# Altium schematic sheet Sheet1(test).SchDoc: ESP8266 Wifi Module
size A4
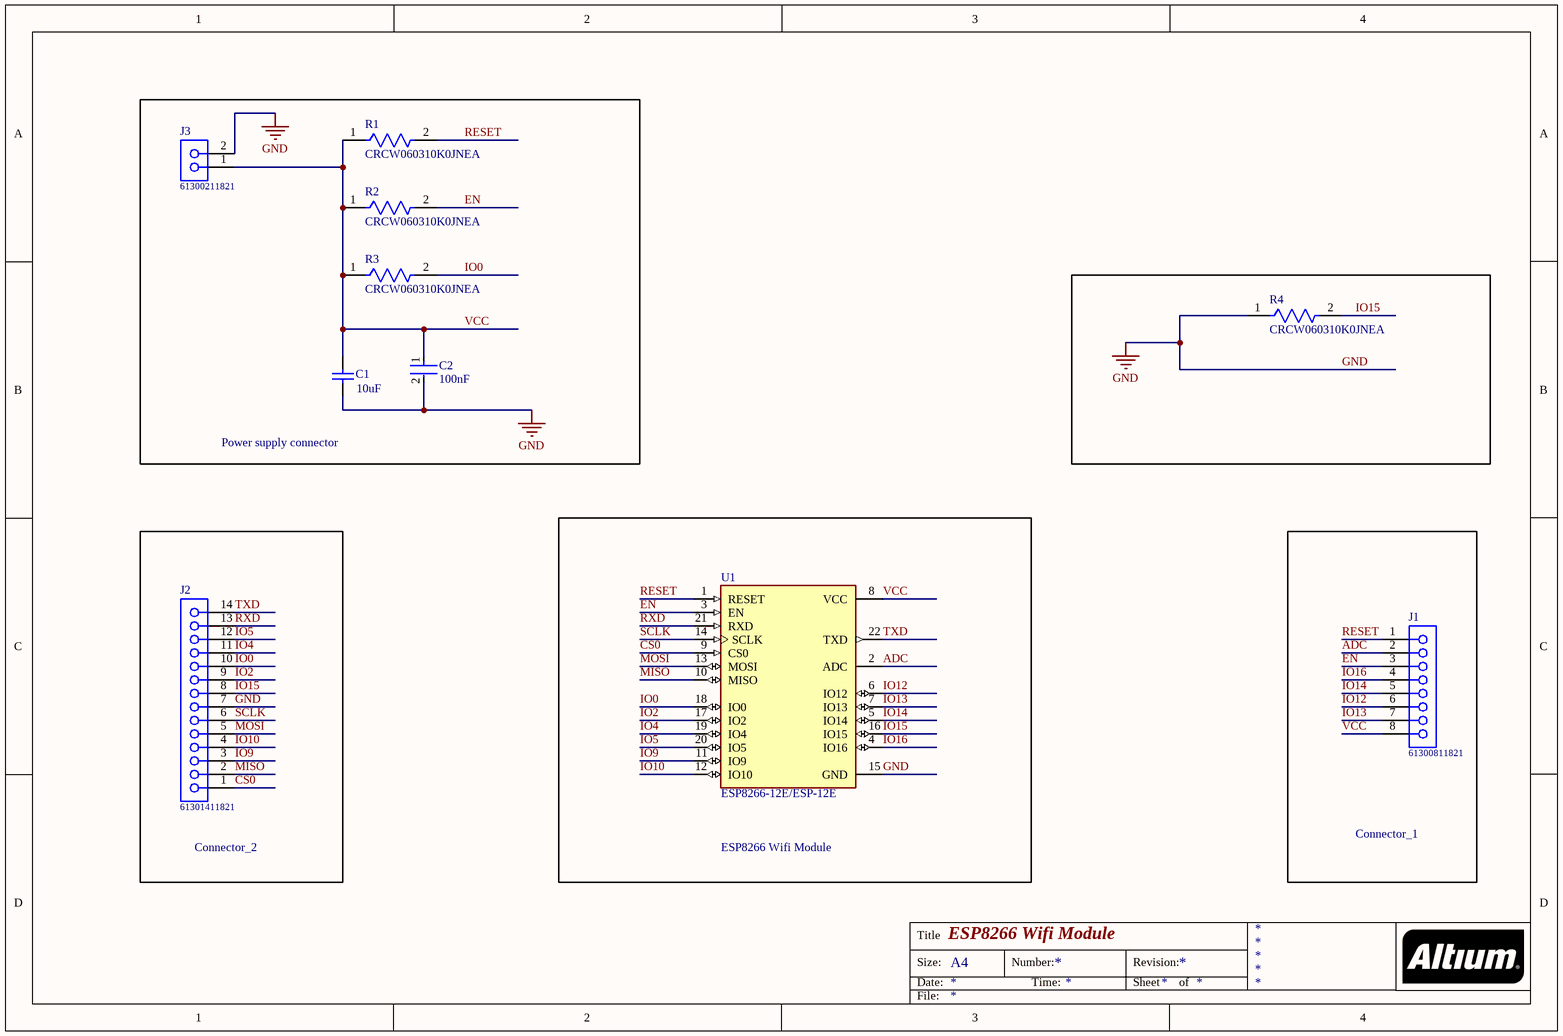
[diagram p0: Sheet1(test).SchDoc]

## Parts
C1  10uF  [CAPC2013X95X45ML10T25]
C2  100nF  [FP-CL43-IPC_B]
J1  61300811821  [61300811821]
J2  61301411821  [61301411821]
J3  61300211821  [61300211821]
R1  CRCW060310K0JNEA  [FP-CRCW0603-e3-MFG]
R2  CRCW060310K0JNEA  [FP-CRCW0603-e3-MFG]
R3  CRCW060310K0JNEA  [FP-CRCW0603-e3-MFG]
R4  CRCW060310K0JNEA  [FP-CRCW0603-e3-MFG]
U1  ESP8266-12E/ESP-12E  [XCVR_ESP8266-12E/ESP-12E]

## Blocks framed on the sheet
Power supply connector: C1 C2 J3 R1-R3
ESP8266 Wifi Module: U1
Connector_2: J2
Connector_1: J1

## Nets
GND: C1.1 C2.2 J2.7 J3.2 R4.1 U1.15(GND)
ADC: J1.2 U1.2(ADC)
CS0: J2.1 U1.9(CS0)
EN: J1.3 R2.2 U1.3(EN)
IO0: J2.10 R3.2 U1.18(IO0)
IO2: J2.9 U1.17(IO2)
IO4: J2.11 U1.19(IO4)
IO5: J2.12 U1.20(IO5)
IO9: J2.3 U1.11(IO9)
IO10: J2.4 U1.12(IO10)
IO12: J1.6 U1.6(IO12)
IO13: J1.7 U1.7(IO13)
IO14: J1.5 U1.5(IO14)
IO15: J2.8 R4.2 U1.16(IO15)
IO16: J1.4 U1.4(IO16)
MISO: J2.2 U1.10(MISO)
MOSI: J2.5 U1.13(MOSI)
RESET: J1.1 R1.2 U1.1(RESET)
RXD: J2.13 U1.21(RXD)
SCLK: J2.6 U1.14(SCLK)
TXD: J2.14 U1.22(TXD)
VCC: C1.2 C2.1 J1.8 J3.1 R1.1 R2.1 R3.1 U1.8(VCC)

## Notes on the sheet
- Title
- Size:
- Date:
- A4
- Number:
- Time:
- Revision:
- Sheet
- of
- File:

## Library data of the parts
C1 = CMP-2007-00182-1: Manufacturer: Murata; Part Number: GRM219R61E106KA12D
C2 = CMP-13271-000927-1: Cap Ceramic 100nF 500V X7R ±10% SMD 1812 +125°C Embossed T/R; Mount: Surface Mount; Capacitance: 100nF; Voltage: 500V; Voltage Rating (DC): 500V; Voltage Rating: 500V; Length: 4.5mm; Height: 2mm; Case/Package: 1812; Radiation Hardening: No; Thickness: 0.087inch; Packaging: Tape and Reel; Package Quantity: 4000; Tolerance: 10%; Dielectric: X7R; Max Operating Temperature: 125°C; Width: 0.126inch; Min Operating Temperature: -55°C; Depth: 3.2mm
J1 = 61300811821: WR-PHD Socket Header, THT, pitch 2.54mm, Single Row, Vertical, 8p; Manufacturer: Wurth Elektronik; Pin Number: 8; Rated Current: 3A; Working Voltage: 250VAC; Withstanding Voltage: 500VAC; Contact Resistance: 20mOhm; ComponentLink1Description: Manufacturer; ComponentLink1URL: http://www.we-online.de; ComponentLink2Description: Datasheet; ComponentLink2URL: https://www.we-online.com/catalog/datasheet/61300811821.pdf; Manufacturer Part Number: 61300811821; Published Date: May 2020; Pitch: 2.54mm; Operating Temperature: -40 to +125degC; Mounting Technology: THT; Packaging: Tray; Gender: Socket Header; Row Number: Single; Orientation: Vertical
J2 = 61301411821: WR-PHD Socket Header, THT, pitch 2.54mm, Single Row, Vertical, 14p; Manufacturer: Wurth Elektronik; Pin Number: 14; Rated Current: 3A; Working Voltage: 250VAC; Withstanding Voltage: 500VAC; Contact Resistance: 20mOhm; ComponentLink1Description: Manufacturer; ComponentLink1URL: http://www.we-online.de; ComponentLink2Description: Datasheet; ComponentLink2URL: https://www.we-online.com/catalog/datasheet/61301411821.pdf; Manufacturer Part Number: 61301411821; Published Date: May 2020; Pitch: 2.54mm; Operating Temperature: -40 to +125degC; Mounting Technology: THT; Packaging: Tray; Gender: Socket Header; Row Number: Single; Orientation: Vertical
J3 = 61300211821: WR-PHD Socket Header, THT, pitch 2.54mm, Single Row, Vertical, 2p; Manufacturer: Wurth Elektronik; Pin Number: 2; Rated Current: 3A; Working Voltage: 250VAC; Withstanding Voltage: 500VAC; Contact Resistance: 20mOhm; ComponentLink1Description: Manufacturer; ComponentLink1URL: http://www.we-online.de; ComponentLink2Description: Datasheet; ComponentLink2URL: https://www.we-online.com/catalog/datasheet/61300211821.pdf; Manufacturer Part Number: 61300211821; Published Date: May 2020; Pitch: 2.54mm; Operating Temperature: -40 to +125degC; Mounting Technology: THT; Packaging: Tray; Gender: Socket Header; Row Number: Single; Orientation: Vertical
R1-R4 = CMP-2000-03838-2: RES Thick Film, 10kΩ, 5%, 0.1W, 200ppm/°C, 0603; Max Power Dissipation: 100mW; Voltage Rating: 75V; Resistance: 10kR; Termination: SMD/SMT; Depth: 0.85mm; Weight: 7.1E-05oz; Military Standard: Not; Case Code (Imperial): 0603; Lead Free: Lead Free; Features: Automotive AEC-Q200; Tolerance: 5%; Case Code (Metric): 1608; Package Quantity: 1; Radiation Hardening: No; Number of Terminations: 2; Max Operating Temperature: 155°C; Min Operating Temperature: -55°C; Composition: Thick Film; Number of Pins: 2; Height: 0.02inch; Contact Plating: Tin; Temperature Coefficient: 200ppm/°C; Width: 0.033inch; Packaging: Tape and Reel; Length: 1.55mm; Mount: Surface Mount; Voltage Rating (DC): 75V; Case/Package: 0603; Power Rating: 100mW
U1 = ESP8266-12E/ESP-12E: This WiFi module has a 32-bit MCU micro and clock speeds supporting 80 MHz or 160 MHz. Supports the RTOS and integrated Wi-Fi MAC/BB/RF/PA/LNA, and has an on-board antenna.; MF: AI-Thinker; Price: None; Package: None; Value: *; MP: ESP8266-12E/ESP-12E; Availability: Unavailable; SnapEDA_Link: https://www.snapeda.com/parts/ESP8266-12E/ESP-12E/AI-Thinker/view-part/106414/?ref=snap